# EAGLE design extincteurtv (EAGLE 4.16)
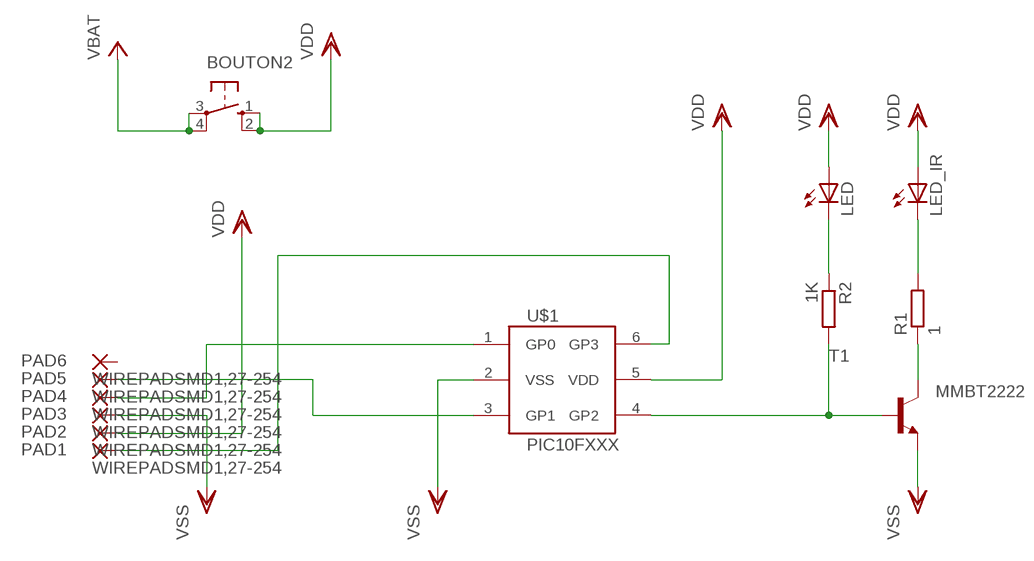
[diagram p0: schematic, sheet 1]

## Parts
BOUTON2  10-XX  [B3F-10XX]
LED  LEDCHIPLED_0805  [CHIPLED_0805]
LED_IR  LED5MM  [LED5MM]
PAD1  WIREPADSMD1,27-254  [SMD1,27-2,54]
PAD2  WIREPADSMD1,27-254  [SMD1,27-2,54]
PAD3  WIREPADSMD1,27-254  [SMD1,27-2,54]
PAD4  WIREPADSMD1,27-254  [SMD1,27-2,54]
PAD5  WIREPADSMD1,27-254  [SMD1,27-2,54]
PAD6  WIREPADSMD1,27-254  [SMD1,27-2,54]
R1  1  R-EU_R1206  [R1206]
R2  1K  R-EU_M0805  [M0805]
T1  MMBT2222  MMBT2222ALT1-NPN-SOT23-BEC  [SOT23-BEC]
U$1  PIC10FXXX  [SOT23-6]

## Nets
N$1: R2.2 T1.B U$1.4(GP2)
N$2: R1.1 T1.C
N$3: LED_IR.K(C) R1.2
N$5: PAD4.1(P) U$1.1(GP0)
N$7: PAD5.1(P) U$1.3(GP1)
N$8: PAD1.1(P) U$1.6(GP3)
N$16: LED.C R2.1
VCC: BOUTON2.3(P) BOUTON2.4(P1) ; supply symbol labelled VBAT
VDD: BOUTON2.1(S) BOUTON2.2(S1) LED.A LED_IR.A PAD2.1(P) U$1.5(VDD)
VSS: PAD3.1(P) T1.E U$1.2(VSS)
Unconnected: PAD6.1(P)

## Library data of the parts
BOUTON2 = switch-omron:10-XX: OMRON SWITCH
LED LED_IR = led:LED: LED OSRAM: - CHIPLED LG R971, LG N971, LY N971, LG Q971, LY Q971, LO R971, LY R971 LH N974, LH R974 LS Q976, LO Q976, LY Q976 LO Q996 - Hyper CHIPLED LW Q18S LB Q993, LB Q99A, LB R99A - SideLED LS A670, LO A670, LY A670, LG A670, LP A670 LB A673, LV A673, LT A673, LW A673 LH A674 LY A675 LS A676, LA A676, LO A676, LY A676, LW A676 LS A679, LY A679, LG A679 - Hyper Micro SIDELED® LS Y876, LA Y876, LO Y876, LY Y876 LT Y87S - SmartLED LW L88C, LW L88S LB L89C, LB L89S, LG L890 LS L89K, LO L89K, LY L89K LS L896, LA L896, LO L896, LY L896 - TOPLED LS T670, LO T670, LY T670, LG T670, LP T670 LSG T670, LSP T670, LSY T670, LOP T670, LYG T670 LG T671, LOG T671, LSG T671 LB T673, LV T673, LT T673, LW T673 LH T674 LS T676, LA T676, LO T676, LY T676, LB T676, LH T676, LSB T676, LW T676 LB T67C, LV T67C, LT T67C, LS T67K, LO T67K, LY T67K, LW E67C LS E67B, LA E67B, LO E67B, LY E67B, LB E67C, LV E67C, LT E67C LW T67C LS T679, LY T679, LG T679 LS T770, LO T770, LY T770, LG T770, LP T770 LB T773, LV T773, LT T773, LW T773 LH T774 LS E675, LA E675, LY E675, LS T675 LS T776, LA T776, LO T776, LY T776, LB T776 LHGB T686 LT T68C, LB T68C - Hyper Mini TOPLED® LB M676 - Mini TOPLED Santana® LG M470 LS M47K, LO M47K, LY M47K Source: http://www.osram.convergy.de/
PAD1-PAD6 = wirepad:WIREPAD: Wire PAD connect wire on PCB
R1 R2 = rcl:R-EU_: RESISTOR, European symbol
T1 = transistor:*-NPN-: NPN Transistror
U$1 = microchip-PIC10F:PIC10FXXX: MICROCONTROLLER 6 pin, 8-Bit Flash

## Board
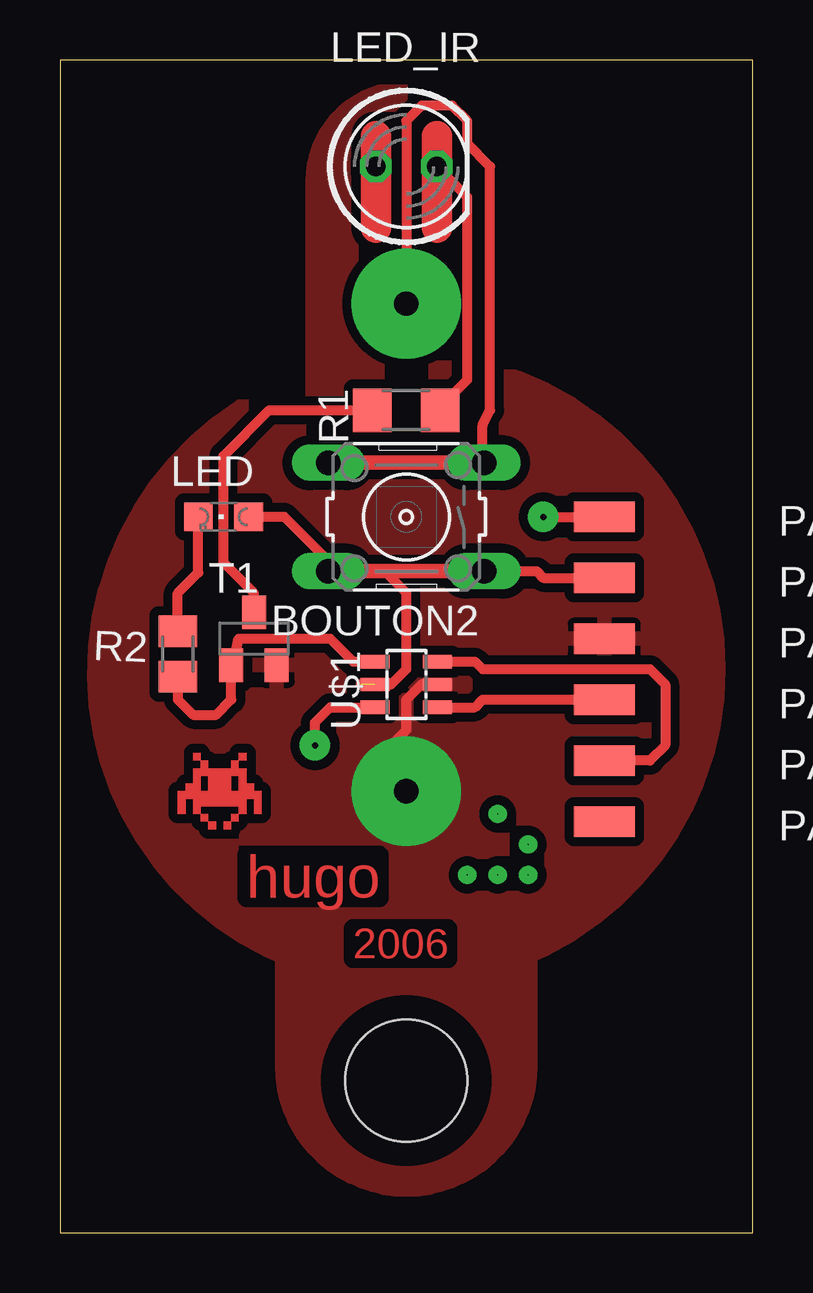
[diagram p1: board, top side]
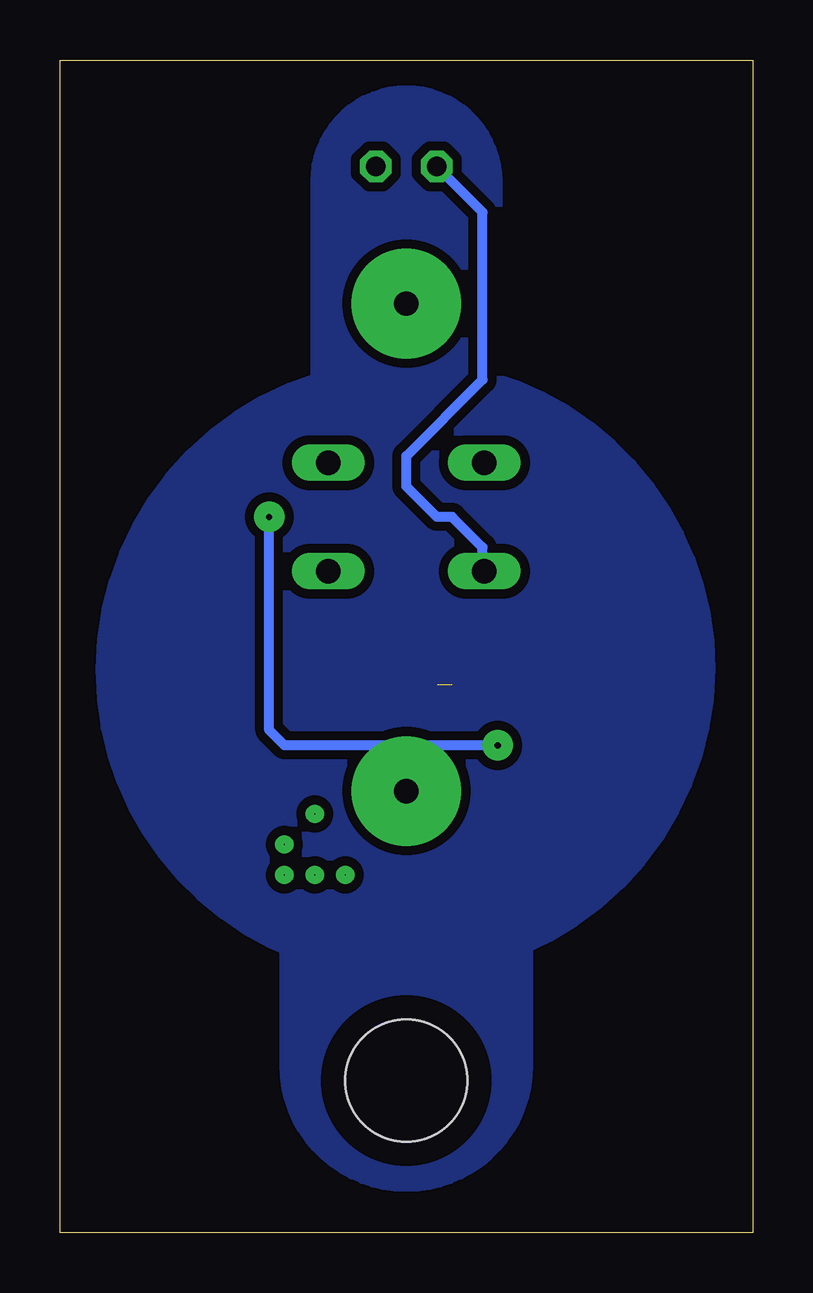
[diagram p2: board, bottom side, seen from below]

Size 28.88 x 48.88 mm. Coordinates in mm from the lower left corner, seen from the top.
Outline: 0,0 28.88,0 28.88,48.88 0,48.88 0,0
Copper layers (1*16): Top 0.035mm / dielectric 1.5mm / Bottom 0.035mm
Design rules "default": minimum track width 10mil, minimum drill 24mil, track to track 8mil, track to pad 8mil, pad to pad 8mil, via to via 8mil, smd to smd 8mil, copper to edge 40mil, drill to drill 8mil, minimum pad ring 10mil, minimum via ring 8mil, stop-mask expansion 4mil, vias tented up to drill 0mil, thermal gap 10mil
Holes 5.08 mm at 14.44,6.34

### Footprints (pad centres in the part's own frame; a part is rotated, then mirrored left to right if it is on the bottom)
B3F-10XX = drill 1.016 long: 1 -3.251,2.261; 2 3.251,2.261; 3 -3.251,-2.261; 4 3.251,-2.261
CHIPLED_0805 = smd 1.2 x 1.2: A 0,-1.05; C 0,1.05
LED5MM = drill 0.813 octagon: A -1.27,0; K 1.27,0
SMD1,27-2,54 = smd 1.27 x 2.54: 1 0,0
R1206 = smd 1.6 x 1.803: 1 -1.422,0; 2 1.422,0
M0805 = smd 1.3 x 1.6: 1 -0.95,0; 2 0.95,0
SOT23-BEC = smd 1 x 1.4: B -0.95,-1.1; C 0,1.1; E 0.95,-1.1
SOT23-6 = smd 0.55 x 1.2: 1 -0.95,-1.3; 2 0,-1.3; 3 0.95,-1.3; 4 0.95,1.3; 5 0.003,1.3; 6 -0.95,1.3

### Placement (x,y rotation side)
BOUTON2  14.44,29.84 180 top
LED  6.82,29.84 90 top
LED_IR  14.44,44.45 0 top
PAD1  22.7,29.84 90 top
PAD2  22.7,27.3 90 top
PAD3  22.7,24.76 90 top
PAD4  22.7,22.22 90 top
PAD5  22.7,19.68 90 top
PAD6  22.7,17.14 90 top
R1  14.44,34.28 0 top
R2  4.92,24.12 270 top
T1  8.09,24.76 0 top
U$1  14.44,22.86 90 top

### Tracks (layer width: path | path; a pad name or v marks a point on that pad's centre or on a via)
N$1
  Top 0.406: U$1.4 12.22,23.8 11.26,24.76 7.46,24.76 7.14,23.18 T1.B 7.31,23.66 7.14,23.49 7.14,22.22 6.5,21.59 5.55,21.59 4.92,22.22 R2.2
N$2
  Top 0.406: T1.C 8.09,26.66 6.82,27.93 6.82,32.38 8.72,34.28 R1.1 12.54,34.92
N$3
  Top 0.406: R1.2 15.86,34.44 16.98,35.55 16.98,43.17 LED_IR.K
N$4
  Top 1.27: 13.17,41.91 13.17,45.72
N$5
  Top 0.406: U$1.1 17.29,21.91 17.61,22.22 PAD4.1
N$6
  Top 1.27: 15.71,41.91 15.71,45.72
N$7
  Top 0.406: U$1.3 17.3,23.8 17.61,23.49 24.6,23.49 25.23,22.86 25.23,20.31 24.6,19.68 PAD5.1
N$8  (via drill 0.25 pad 1.27)
  Top 0.406: U$1.6 11.58,21.91 11.58,21.9 11.26,21.9 10.63,21.27 v10.63,20.31 | v20.15,29.84 PAD1.1
  Bottom 0.406: v20.15,29.84 20.15,20.95 19.52,20.31 v10.63,20.31
N$9
  pour Top (isolate 0.381): 9.36,6.98 arc90 14.44,1.9 arc90 19.52,6.98 19.52,12.06 9.36,12.06
N$10  (via drill 1.02 pad 4.57)
  other vias: 14.44,38.73
N$11
  pour Top (isolate 0.381): 10.63,43.81 arc-90 14.44,47.62 arc-90 18.25,43.81 18.25,34.92 10.63,34.92
N$12
  pour Bottom (isolate 0.381): 1.74,23.49 arc-90 14.44,36.19 arc-95 27.14,22.22 arc-85 14.44,10.79 arc-89
N$13
  pour Bottom (isolate 0.381): 9.36,6.98 arc90 14.44,1.9 arc90 19.52,6.98 19.52,12.06 9.36,12.06
N$14
  pour Bottom (isolate 0.381): 10.63,34.92 10.63,43.81 arc-90 14.44,47.62 arc-90 18.25,43.81 18.25,34.92
N$16
  Top 0.406: R2.1 4.92,26.66 5.77,27.52 LED.C
N$23  (via drill 0.03 pad 0.76)
  other vias: 19.52,14.92
N$24  (via drill 0.03 pad 0.76)
  other vias: 18.25,14.92
N$25  (via drill 0.03 pad 0.76)
  other vias: 16.98,14.92
N$26  (via drill 0.03 pad 0.76)
  other vias: 19.52,16.19
N$27  (via drill 0.03 pad 0.76)
  other vias: 18.25,17.46
VBAT
  Top 0.406: 14.44,38.73 14.44,46.35 15.07,46.98 16.34,46.98 16.98,46.35 16.98,45.4 17.93,44.45 17.93,34.28 17.61,33.65 17.61,32.38 18.25,32.38
VCC
  Top 0.61: 17.61,32.1 BOUTON2.3 | BOUTON2.4 17.61,32.1 | 17.61,32.1 17.61,32.38
VDD  (1 unrouted)
  Top 0.406: BOUTON2.1 19.88,27.58 20.15,27.3 PAD2.1 | 12.54,22.86 13.8,22.86 14.44,23.49 14.44,26.66 13.53,27.58 11.9,27.58 11.9,27.3 9.36,29.84 LED.A
  Top 0.61: 17.61,27.58 BOUTON2.1 | BOUTON2.2 11.9,27.58 17.61,27.58 | 17.61,27.58 17.61,27.3
  Bottom 0.406: LED_IR.A 11.26,42.54 11.26,35.55 14.44,32.38 14.44,31.11 13.17,29.84 12.54,29.84 11.26,28.57 11.26,27.93 BOUTON2.2
VSS  (via drill 1.02 pad 4.57)
  Top 0.406: U$1.2 15.07,22.86 14.44,22.22 14.44,20.95 13.8,20.31
  other vias: 14.44,18.41
  pour Top (isolate 0.381): 1.42,23.17 arc-90 14.44,36.51 arc-90 27.46,23.49 arc-90 14.44,10.47 arc-90
(copper drawn outside any net)
  shapes: Top area x33

### Text on the board
Top: hugo | 2006